# EAGLE design l298 (EAGLE 6.5.0)
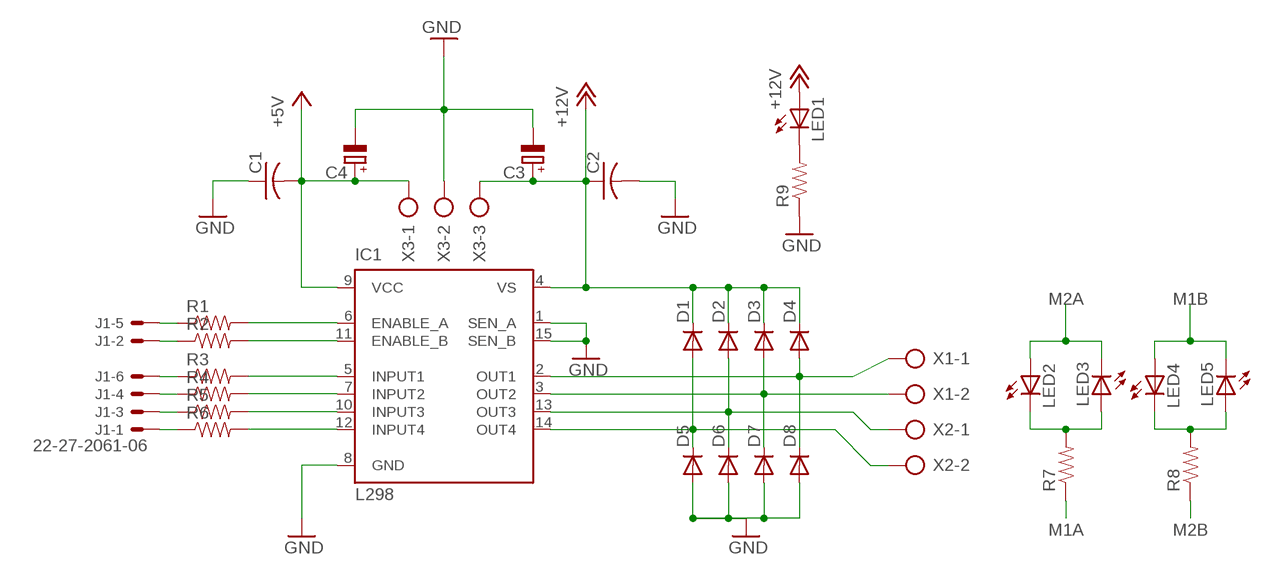
[diagram p0: schematic, sheet 1]

## Parts
C1  C-US025-024X044  [C025-024X044]
C2  C-US025-024X044  [C025-024X044]
C3  CPOL-EUE5-10.5  [E5-10,5]
C4  CPOL-EUE2-5  [E2-5]
D1  DIODE1N4148  [DIODE-1N4148]
D2  DIODE1N4148  [DIODE-1N4148]
D3  DIODE1N4148  [DIODE-1N4148]
D4  DIODE1N4148  [DIODE-1N4148]
D5  DIODE1N4148  [DIODE-1N4148]
D6  DIODE1N4148  [DIODE-1N4148]
D7  DIODE1N4148  [DIODE-1N4148]
D8  DIODE1N4148  [DIODE-1N4148]
IC1  L298  [MULTIWATT-15]
J1  22-27-2061-06  [6410-06]
LED1  LED3MM  [LED3MM]
LED2  LED3MM  [LED3MM]
LED3  LED3MM  [LED3MM]
LED4  LED3MM  [LED3MM]
LED5  LED3MM  [LED3MM]
R1  RESISTORPTH-1/6W  [1/6W-RES]
R2  RESISTORPTH-1/6W  [1/6W-RES]
R3  RESISTORPTH-1/6W  [1/6W-RES]
R4  RESISTORPTH-1/6W  [1/6W-RES]
R5  RESISTORPTH-1/6W  [1/6W-RES]
R6  RESISTORPTH-1/6W  [1/6W-RES]
R7  RESISTORPTH-1/6W  [1/6W-RES]
R8  RESISTORPTH-1/6W  [1/6W-RES]
R9  RESISTORPTH-1/6W  [1/6W-RES]
X1  AK500/2  [AK500/2]
X2  AK500/2  [AK500/2]
X3  AK500/3  [AK500/3]

## Nets
2A: IC1.10(INPUT3) R5.2
+5V: C1.2 C4.+ IC1.9(VCC) X3.1
+12V: C2.1 C3.+ D1.C D2.C D3.C D4.C IC1.4(VS) LED1.A X3.3
A1: IC1.5(INPUT1) R3.2
B1: IC1.7(INPUT2) R4.2
B2: IC1.12(INPUT4) R6.2
GND: C1.1 C2.2 C3.- C4.- D5.A D6.A D7.A D8.A IC1.1(SEN_A) IC1.8(GND) IC1.15(SEN_B) R9.1 X3.2
M1A: D4.A D8.C IC1.2(OUT1) R7.1 X1.1
M1B: D2.A D6.C IC1.13(OUT3) LED4.A LED5.K(C) X2.1
M2A: D3.A D7.C IC1.3(OUT2) LED2.A LED3.K(C) X1.2
M2B: D1.A D5.C IC1.14(OUT4) R8.1 X2.2
N$1: J1.5 R1.1
N$2: J1.2 R2.1
N$3: J1.6 R3.1
N$4: J1.4 R4.1
N$5: LED4.K(C) LED5.A R8.2
N$6: LED2.K(C) LED3.A R7.2
N$7: J1.3 R5.1
N$8: LED1.K(C) R9.2
N$9: J1.1 R6.1
PWMA: IC1.6(ENABLE_A) R1.2
PWMB: IC1.11(ENABLE_B) R2.2

## Library data of the parts
C1 C2 = rcl:C-US: CAPACITOR, American symbol
C3 C4 = rcl:CPOL-EU: POLARIZED CAPACITOR, European symbol
D1-D8 = SparkFun:DIODE: Diode These are standard reverse protection diodes and small signal diodes. SMA package can handle up to about 1A. SOD-323 can handle about 200mA. What the SOD-323 package when ordering, there are some mfgs out there that are 5-pin packages.
IC1 = st-microelectronics:L298: DUAL FULL-BRIDGE DRIVER
J1 = con-molex:22-?-06: CONNECTOR wire to board 2.54 mm (.1 inch) pitch header; OC_FARNELL: unknown; OC_NEWARK: unknown
LED1-LED5 = led:LED: LED OSRAM: - CHIPLED LG R971, LG N971, LY N971, LG Q971, LY Q971, LO R971, LY R971 LH N974, LH R974 LS Q976, LO Q976, LY Q976 LO Q996 - Hyper CHIPLED LW Q18S LB Q993, LB Q99A, LB R99A - SideLED LS A670, LO A670, LY A670, LG A670, LP A670 LB A673, LV A673, LT A673, LW A673 LH A674 LY A675 LS A676, LA A676, LO A676, LY A676, LW A676 LS A679, LY A679, LG A679 - Hyper Micro SIDELED® LS Y876, LA Y876, LO Y876, LY Y876 LT Y87S - SmartLED LW L88C, LW L88S LB L89C, LB L89S, LG L890 LS L89K, LO L89K, LY L89K LS L896, LA L896, LO L896, LY L896 - TOPLED LS T670, LO T670, LY T670, LG T670, LP T670 LSG T670, LSP T670, LSY T670, LOP T670, LYG T670 LG T671, LOG T671, LSG T671 LB T673, LV T673, LT T673, LW T673 LH T674 LS T676, LA T676, LO T676, LY T676, LB T676, LH T676, LSB T676, LW T676 LB T67C, LV T67C, LT T67C, LS T67K, LO T67K, LY T67K, LW E67C LS E67B, LA E67B, LO E67B, LY E67B, LB E67C, LV E67C, LT E67C LW T67C LS T679, LY T679, LG T679 LS T770, LO T770, LY T770, LG T770, LP T770 LB T773, LV T773, LT T773, LW T773 LH T774 LS E675, LA E675, LY E675, LS T675 LS T776, LA T776, LO T776, LY T776, LB T776 LHGB T686 LT T68C, LB T68C - Hyper Mini TOPLED® LB M676 - Mini TOPLED Santana® LG M470 LS M47K, LO M47K, LY M47K Source: http://www.osram.convergy.de LUXEON: - LUMILED® LXK2-PW12-R00, LXK2-PW12-S00, LXK2-PW14-U00, LXK2-PW14-V00 LXK2-PM12-R00, LXK2-PM12-S00, LXK2-PM14-U00 LXK2-PE12-Q00, LXK2-PE12-R00, LXK2-PE12-S00, LXK2-PE14-T00, LXK2-PE14-U00 LXK2-PB12-K00, LXK2-PB12-L00, LXK2-PB12-M00, LXK2-PB14-N00, LXK2-PB14-P00, LXK2-PB14-Q00 LXK2-PR12-L00, LXK2-PR12-M00, LXK2-PR14-Q00, LXK2-PR14-R00 LXK2-PD12-Q00, LXK2-PD12-R00, LXK2-PD12-S00 LXK2-PH12-R00, LXK2-PH12-S00 LXK2-PL12-P00, LXK2-PL12-Q00, LXK2-PL12-R00 Source: www.luxeon.com KINGBRIGHT: KA-3528ASYC Source: www.kingbright.com
R1-R9 = SparkFun:RESISTOR: Resistor Basic schematic elements and footprints for 0603, 1206, and PTH 1/10th watt (small) resistors.
X1 X2 = con-ptr500:AK500/2: CONNECTOR; OC_FARNELL: unknown; OC_NEWARK: unknown
X3 = con-ptr500:AK500/3: CONNECTOR; OC_FARNELL: unknown; OC_NEWARK: unknown

## Board
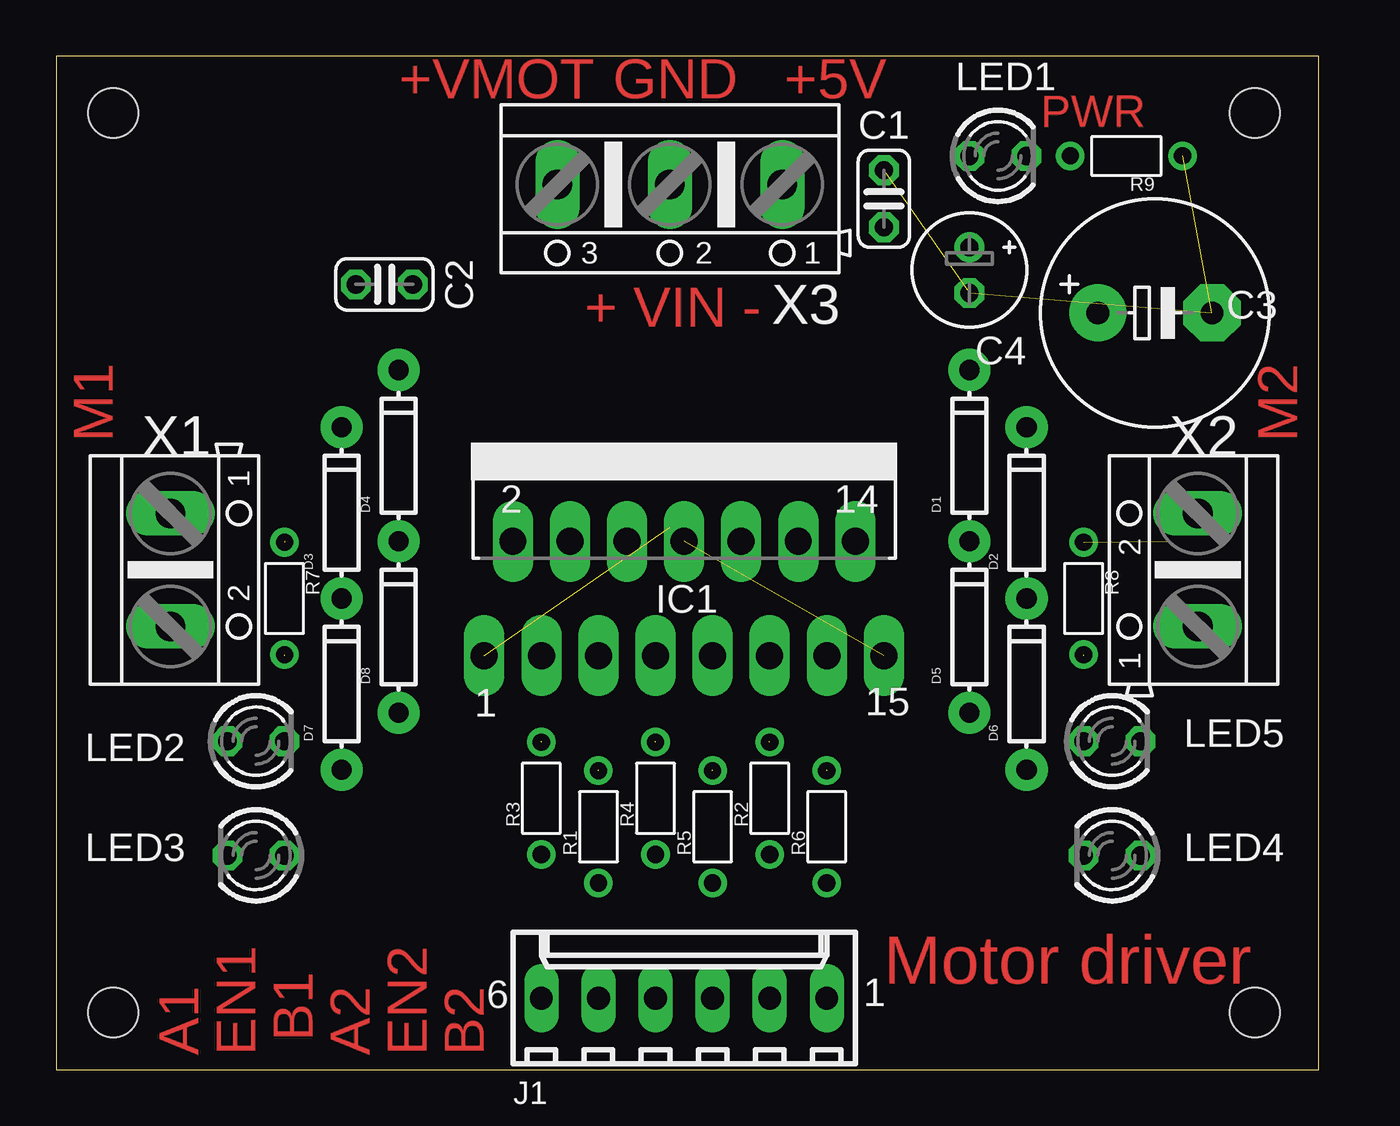
[diagram p1: board, top side]
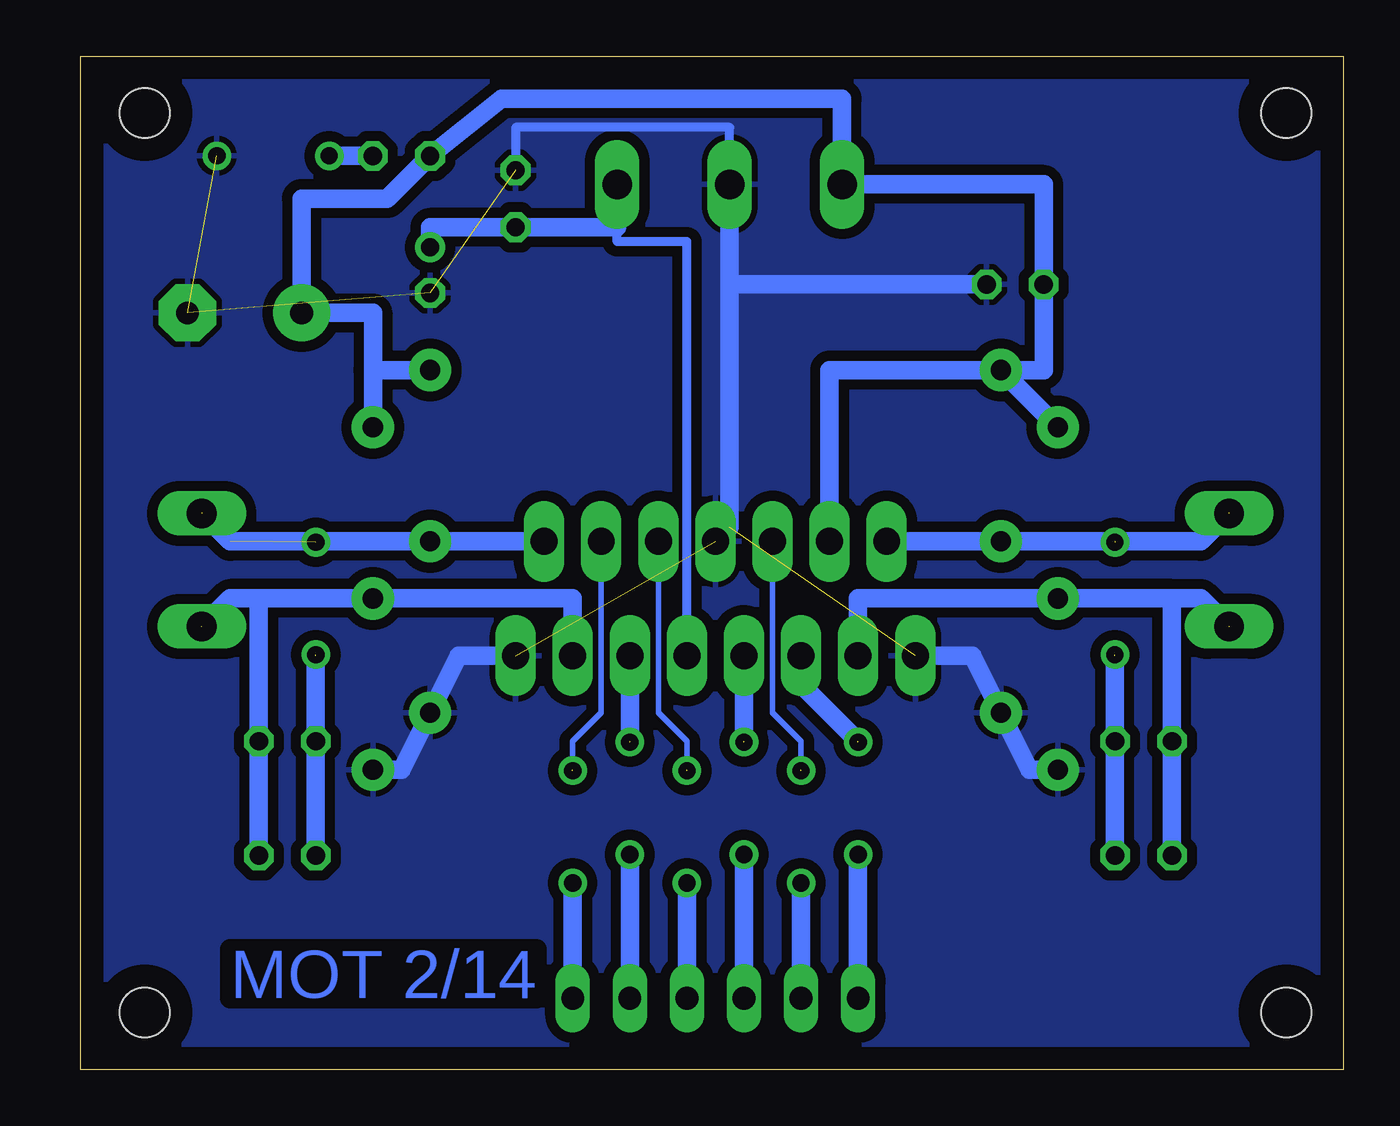
[diagram p2: board, bottom side, seen from below]

Size 56.19 x 45.07 mm. Coordinates in mm from the lower left corner, seen from the top.
Outline: 0,0 56.19,0 56.19,45.07 0,45.07 0,0
Copper layers (1*16): Top 0.035mm / dielectric 1.5mm / Bottom 0.035mm
Design rules "default *": minimum track width 10mil, minimum drill 24mil, track to track 18mil, track to pad 18mil, pad to pad 8mil, via to via 8mil, smd to smd 8mil, copper to edge 40mil, drill to drill 8mil, minimum pad ring 10mil, minimum via ring 8mil, stop-mask expansion 4mil, vias tented up to drill 0mil, thermal gap 10mil
Holes 2.2 mm at 2.54,42.55 53.34,42.55 53.34,2.54 2.54,2.54

### Footprints (pad centres in the part's own frame; a part is rotated, then mirrored left to right if it is on the bottom)
C025-024X044 = drill 0.813 octagon: 1 -1.27,0; 2 1.27,0
E5-10,5 = drill 1.016 pad 2.54: + -2.54,0 | drill 1.016 pad 2.54 octagon: - 2.54,0
E2-5 = drill 0.813 pad 1.27: + -1.016,0 | drill 0.813 pad 1.27 octagon: - 1.016,0
DIODE-1N4148 = drill 0.9 pad 1.88: A -3.81,0; C 3.81,0
MULTIWATT-15 = drill 1.2 long: 1 -8.89,-7.62; 2 -7.62,-2.54; 3 -6.35,-7.62; 4 -5.08,-2.54; 5 -3.81,-7.62; 6 -2.54,-2.54; 7 -1.27,-7.62; 8 0,-2.54; 9 1.27,-7.62; 10 2.54,-2.54; 11 3.81,-7.62; 12 5.08,-2.54; 13 6.35,-7.62; 14 7.62,-2.54; 15 8.89,-7.62
6410-06 = drill 1.016 long: 1 6.35,0; 2 3.81,0; 3 1.27,0; 4 -1.27,0; 5 -3.81,0; 6 -6.35,0
LED3MM = drill 0.813 octagon: A -1.27,0; K 1.27,0
1/6W-RES = drill 0.762: 1 -2.5,0; 2 2.5,0
AK500/2 = drill 1.321 long: 1 -2.515,0; 2 2.515,0
AK500/3 = drill 1.321 long: 1 -5.004,0; 2 0,0; 3 5.004,0

### Placement (x,y rotation side)
C1  36.83,38.73 270 top
C2  14.61,34.92 0 top
C3  48.9,33.66 0 top
C4  40.64,35.56 270 top
D1  40.64,27.3 90 top
D2  43.18,24.77 90 top
D3  12.7,24.77 90 top
D4  15.24,27.3 90 top
D5  40.64,19.68 90 top
D6  43.18,17.14 90 top
D7  12.7,17.14 90 top
D8  15.24,19.68 90 top
IC1  27.94,26.04 0 top
J1  27.94,3.17 0 top
LED1  41.91,40.64 0 top
LED2  8.89,14.61 0 top
LED3  8.89,9.53 180 top
LED4  46.99,9.53 180 top
LED5  46.99,14.61 0 top
R1  24.13,10.79 90 top
R2  31.75,12.07 90 top
R3  21.59,12.07 90 top
R4  26.67,12.07 90 top
R5  29.21,10.79 90 top
R6  34.29,10.79 90 top
R7  10.16,20.95 270 top
R8  45.72,20.95 270 top
R9  47.62,40.64 180 top
X1  5.08,22.22 270 top
X2  50.8,22.22 90 top
X3  27.3,39.37 180 top

### Tracks (layer width: path | path; a pad name or v marks a point on that pad's centre or on a via)
2A  (1 unrouted)
  Bottom 0.254: 29.21,13.34 29.21,14.61 30.48,15.88 IC1.10
+5V
  Bottom 0.406: IC1.9 29.21,36.83 32.31,36.83 32.31,37.46
  Bottom 0.813: X3.1 32.31,37.46 C1.2 40.64,37.46 C4.+
+12V
  Bottom 0.813: D3.C D4.C | D1.C 43.18,31.12 | 43.18,31.12 D2.C | 43.18,31.12 43.18,33.66 C3.+ 46.36,38.73 42.55,38.73 LED1.A 37.47,43.18 22.3,43.18 X3.3 13.34,39.37 C2.1 13.34,31.12 D4.C | D4.C 22.86,31.12 IC1.4
A1  (1 unrouted)
  Bottom 0.254: 24.13,17.14 IC1.5
  Bottom 0.813: 21.59,14.61 24.13,17.14
B1  (1 unrouted)
  Bottom 0.813: 26.67,14.61 IC1.7
B2  (1 unrouted)
  Bottom 0.254: 34.29,13.34 34.29,14.61 33.02,15.88 IC1.12
GND  (5 unrouted)
  Bottom 0.406: X3.2 27.3,41.91 36.83,41.91 C1.1
  Bottom 0.813: D6.A 41.91,13.34 D5.A 39.37,18.41 IC1.15 | D7.A 13.97,13.34 D8.A 16.51,18.41 IC1.1 | X3.2 27.3,34.92 | 27.3,34.92 27.3,24.13 IC1.8 | C2.2 27.3,34.92
  pour Bottom: 0,45.09 0,0 55.88,0 55.88,45.09
M1A  (2 unrouted)
  Bottom 0.813: IC1.2 D8.C 10.16,23.49 6.35,23.49 5.08,24.77
M1B  (1 unrouted)
  Bottom 0.813: IC1.13 34.29,20.95 D6.C 48.26,20.95 | 48.26,20.95 49.53,20.95 50.8,19.68 | LED4.A LED5.K 48.26,20.95
M2A  (1 unrouted)
  Bottom 0.813: IC1.3 21.59,20.95 D3.A 7.62,20.95 | 7.62,20.95 6.35,20.95 5.08,19.68 | LED3.K LED2.A 7.62,20.95
M2B  (2 unrouted)
  Bottom 0.813: IC1.14 D1.A 49.53,23.49 50.8,24.77
N$1
  Bottom 0.813: R1.1 J1.5
N$2
  Bottom 0.813: R2.1 J1.2
N$3
  Bottom 0.813: R3.1 J1.6
N$4
  Bottom 0.813: R4.1 J1.4
N$5  (1 unrouted)
  Bottom 0.813: 45.72,18.41 LED4.K LED5.A
N$6  (1 unrouted)
  Bottom 0.813: 10.16,18.41 LED2.K LED3.A
N$7
  Bottom 0.813: R5.1 J1.3
N$8
  Bottom 0.813: R9.2 LED1.K
N$9
  Bottom 0.813: R6.1 J1.1
PWMA  (1 unrouted)
  Bottom 0.254: 24.13,13.34 24.13,14.61 25.4,15.88 IC1.6
PWMB  (1 unrouted)
  Bottom 0.813: 31.75,14.61 IC1.11

### Text on the board
Top: +VMOT | GND | +5V | PWR | + VIN - | M1 | M2 | Motor driver | A1 | EN1 | B1 | A2 | EN2 | B2
Bottom: MOT 2/14